# Altium schematic sheet Charging&1AOut1.SchDoc
size A; DocumentNumber: 4; SheetNumber: 4; SheetTotal: 7
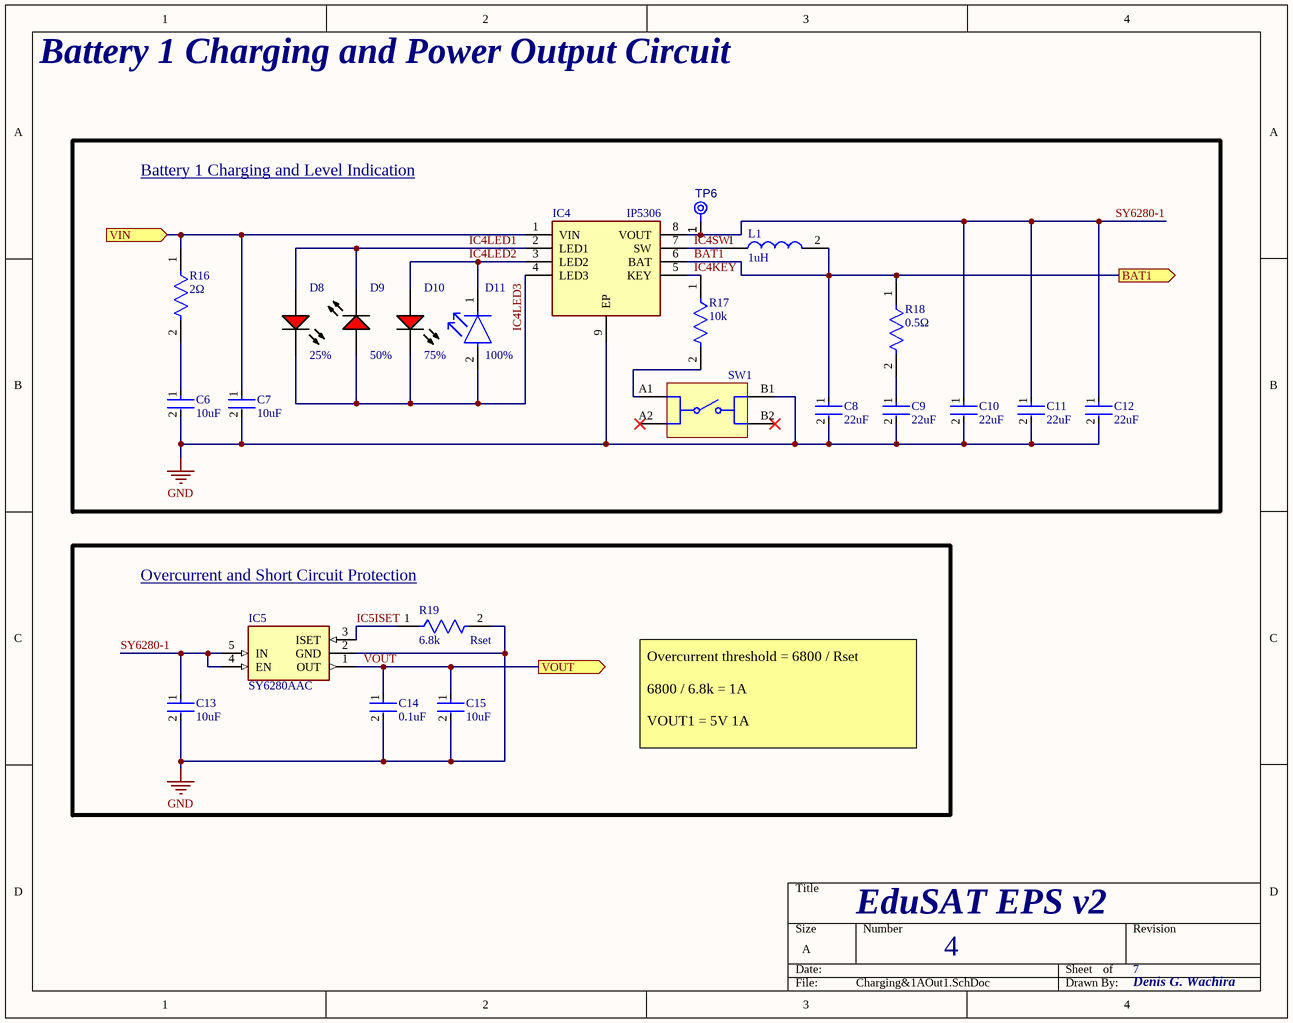
[diagram p0: Charging&1AOut1.SchDoc]

## Parts
C6  10uF  [FP-CL21-IPC_A]
C7  10uF  [FP-CL21-IPC_A]
C8  22uF  [FP-CL21-IPC_C]
C9  22uF  [FP-CL21-IPC_C]
C10  22uF  [FP-CL21-IPC_C]
C11  22uF  [FP-CL21-IPC_C]
C12  22uF  [FP-CL21-IPC_C]
C13  10uF  [FP-CL21-IPC_A]
C14  0.1uF  [FP-CL21-IPC_A]
C15  10uF  [FP-CL21-IPC_A]
D8  25%  [LTST-C170KRKT_V]
D9  50%  [LTST-C170KRKT_V]
D10  75%  [LTST-C170KRKT_V]
D11  100%  [FP-LTST-C170GKT-MFG]
IC4  IP5306  [SOIC127P600X165-9N]
IC5  SY6280AAC  [SOT95P285X140-5N]
L1  1uH  [INDPM7366X300N]
R16  2Ω  [FP-CR0805-IPC_B]
R17  10k  [FP-MCR10-IPC_C]
R18  0.5Ω  [FP-MCR10-IPC_C]
R19  6.8k          Rset  [FP-MCR10-IPC_C]
SW1  430181038816  [WS-TASV_L4.5W4.5H3.8_430181038816]  (value not drawn)
TP6  TPAD6R  [TP06R]  (value not drawn)  (no BOM)

## Blocks framed on the sheet
Battery 1 Charging and Level Indication: C6-C12 D8-D11 IC4 L1 R16-R18 SW1 TP6
Overcurrent and Short Circuit Protection: C13-C15 IC5 R19

## Ports
BAT1 (out, see EduSAT-EPSv2[3B], BatteryConn&Protection[3A]), VIN (in, see EduSAT-EPSv2[2B], Charging&1AOut2[1A], Charging&1AOut3[1A], PowerInput&Switch[4C]), VOUT (out, see EduSAT-EPSv2[3B], Charging&1AOut2[2C], Charging&1AOut3[2C], PowerOutput&Switch[1A])

## Nets
GND: C6.2 C7.2 C8.2 C9.2 C10.2 C11.2 C12.2 C13.2 C14.2 C15.2 IC4.9(EP) IC5.2(GND) R19.2 SW1.B1
BAT1: C8.1 IC4.6(BAT) L1.2 R18.1 ; port BAT1
IC4KEY: IC4.5(KEY) R17.1
IC4LED1: D8.1(A) D9.2(K) IC4.2(LED1)
IC4LED2: D10.1(A) D11.1(C) IC4.3(LED2)
IC4LED3: D8.2(K) D9.1(A) D10.2(K) D11.2(A) IC4.4(LED3)
IC4SW: IC4.7(SW) L1.1
IC5ISET: IC5.3(ISET) R19.1
SY6280-1: C10.1 C11.1 C12.1 C13.1 IC4.8(VOUT) IC5.4(EN) IC5.5(IN) TP6.1(TP)
VIN: C7.1 IC4.1(VIN) R16.1 ; port VIN
VOUT: C14.1 C15.1 IC5.1(OUT) ; port VOUT
NetC6_1: C6.1 R16.2
NetC9_1: C9.1 R18.2
NetR17_2: R17.2 SW1.A1

Not connected (* = marked no-connect by the designer): SW1 A2* B2*

## Notes on the sheet
- Battery 1 Charging and Power Output Circuit
- Overcurrent threshold = 6800 / Rset
  6800 / 6.8k = 1A
  VOUT1 = 5V 1A
- EduSAT EPS v2
- Denis G. Wachira

## Library data of the parts
C6 C7 C13 C15 = CMP-13271-002975-1: CL21 Series 0805 10uF 25V ±10% Tolerance X5R Multilayer Ceramic Chip Capacitor CL21A106KAYNNNE; Case Code (Imperial): 0805; Length: 2mm; Case/Package: 0805; Packaging: Tape and Reel; Width: 0.049inch; Tolerance: 10%; Mount: Surface Mount; Min Operating Temperature: -55°C; Thickness: 0.057inch; Height: 1.25mm; Dielectric: X5R; Package Quantity: 1; Depth: 1.25mm; Capacitance: 10uF; Voltage Rating: 25V; Case Code (Metric): 2012; Max Operating Temperature: 85°C; Radiation Hardening: No
C8-C12 = CMP-13271-003225-1: CL21 Series 0805 22uF 25V ±20% Tolerance X5R Multilayer Ceramic Chip Capacitor CL21A226MAYNNNE
C14 = CMP-13271-002975-1: 50V 0.1uF X7R ±10% 0805 Multilayer Ceramic Capacitors MLCC - SMD/SMT ROHS TCC0805X7R104K500DT; Case Code (Imperial): 0805; Length: 2mm; Case/Package: 0805; Packaging: Tape and Reel; Width: 0.049inch; Tolerance: 10%; Mount: Surface Mount; Min Operating Temperature: -55°C; Thickness: 0.057inch; Height: 1.25mm; Dielectric: X7R; Package Quantity: 1; Depth: 1.25mm; Capacitance: 0.1uF; Voltage Rating: 50V; Case Code (Metric): 2012; Max Operating Temperature: 85°C; Radiation Hardening: No
D8 = CMP-2000-07593-1: LED Red,KT-0805R; Manufacturer: Lite-On; Lens Transparency: Clear; Number of Elements: 1; Power Rating: 75mW; Luminous Intensity: 54mcd; Viewing Angle: 130degrees; Forward Current: 30mA; Wavelength: 639nm; Lens Style: Rectangular; Case\/Package: 0805; Test Current: 20mA; Dominant Wavelength: 631nm; Forward Voltage: 2V; Lens Colour: Colorless; Min Operating Temperature: -55degC; RoHSCompliant: True; Length: 3.2mm; Width: 1.25mm; Mount: SurfaceMount; Packaging: TapeandReel; Number of LEDs: 1; Radiation Hardening: No; Datasheet URL: http://optoelectronics.liteon.com/upload/download/DS-22-99-0150/LTST-C170KRKT.pdf; Datasheet Version: Rev. D, 11/2014; Case Code (Metric): 2012; Height: 1.1mm; Number of Pins: 2; Package Description: 2-Pin Surface Mount Device, Body 2 x 1.25 mm; Manufacturer URL: http://www.us.liteon.com/; Lead Free: LeadFree; Illumination Colour: Red; Colour: Red; Case Code (Imperial): 0805; Max Operating Temperature: 85degC; Power Dissipation: 75mW; Mounting Technology: SurfaceMount; Package Reference: C170KRKT; Package Quantity: 1; Depth: 1.6mm
D9 D10 = CMP-2000-07593-1: LED Red, KT-0805R; Manufacturer: Lite-On; Lens Transparency: Clear; Number of Elements: 1; Power Rating: 75mW; Luminous Intensity: 54mcd; Viewing Angle: 130degrees; Forward Current: 30mA; Wavelength: 639nm; Lens Style: Rectangular; Case\/Package: 0805; Test Current: 20mA; Dominant Wavelength: 631nm; Forward Voltage: 2V; Lens Colour: Colorless; Min Operating Temperature: -55degC; RoHSCompliant: True; Length: 3.2mm; Width: 1.25mm; Mount: SurfaceMount; Packaging: TapeandReel; Number of LEDs: 1; Radiation Hardening: No; Datasheet URL: http://optoelectronics.liteon.com/upload/download/DS-22-99-0150/LTST-C170KRKT.pdf; Datasheet Version: Rev. D, 11/2014; Case Code (Metric): 2012; Height: 1.1mm; Number of Pins: 2; Package Description: 2-Pin Surface Mount Device, Body 2 x 1.25 mm; Manufacturer URL: http://www.us.liteon.com/; Lead Free: LeadFree; Illumination Colour: Red; Colour: Red; Case Code (Imperial): 0805; Max Operating Temperature: 85degC; Power Dissipation: 75mW; Mounting Technology: SurfaceMount; Package Reference: C170KRKT; Package Quantity: 1; Depth: 1.6mm
D11 = CMP-1674-00002-6: LED GREEN CLEAR SMD KT-0805G; Dominant Wavelength: 569nm; Lens Style: Diffused; Forward Voltage: 2.1V; Number of Elements: 1; Wavelength: 565nm; Luminous Intensity: 6mcd; Test Current: 10mA; Power Dissipation: 100mW; Reverse Voltage: 5V; Forward Current: 30mA; Viewing Angle: 130°; Lens Color: Colorless; Min Operating Temperature: -55°C; Number of Pins: 2; Max Operating Temperature: 85°C; Color: Green; Radiation Hardening: No; Illumination Color: Green; Case Code (Metric): 2012; Lens Transparency: Clear; Case/Package: 0805; Width: 1.25mm; Case Code (Imperial): 0805; Package Quantity: 1; Height: 1.1mm; Depth: 1.25mm; Length: 2mm; Power Rating: 100mW; Lead Free: Lead Free; Number of LEDs: 1; Packaging: Tape and Reel; Mount: Surface Mount; Voltage: 5V
IC4 = IP5306: Integrated Circuit; Manufacturer_Name: INJOINIC; Datasheet Link: https://datasheetspdf.com/pdf-file/1139129/Injoinic/IP5306/1; Height: 1.65mm; Manufacturer_Part_Number: IP5306
IC5 = SY6280AAC: Integrated Circuit; Manufacturer_Name: Silergy; Datasheet Link: https://datasheet.lcsc.com/szlcsc/Silergy-Corp-SY6280AAC_C55136.pdf; Height: 1.4mm; Manufacturer_Part_Number: SY6280AAC
L1 = MCS0630-2R2MN2: Inductor MCS0630-1R0MN2; Manufacturer_Name: Prosperity Dielectrics; Height: 3mm; Manufacturer_Part_Number: MCS0630-1R0MN2
R16 = CMP-07231-004400-1: Thick Film Chip Resistors 0805 2Ω 0.125W 1% 250ppm/°C / RS-05L2R00FT; Power Rating: 125mW; Voltage Rating: 150V; Packaging: Tape and Reel; Thickness: 508um; Case Code (Metric): 2012; Military Standard: Not; Height: 0.5mm; Depth: 1.25mm; Weight: 0.000194oz; Length: 2mm; Resistance: 2Ω; Min Operating Temperature: -55°C; Radiation Hardening: No; Case/Package: 0805; Tolerance: 1%; Mount: Surface Mount; Width: 1.25mm; Max Operating Temperature: 155°C; Contact Plating: Tin; Temperature Coefficient: 250ppm/°C; Case Code (Imperial): 0805; Composition: Thick Film; Termination: SMD/SMT
R17 = CMP-08839-012433-1: Thick Film Chip Resistor, 0805, 10kΩ, 1%, 100ppm/°C, 0.125W, 150V / 0805W8F1002T5E; Resistance: 10kR; Power Rating: 125mW; Resistor Type: Thick Film; Contact Plating: Tin; Length: 2mm; Tolerance: 1%; Temperature Coefficient: 100ppm/°C; Max Operating Temperature: 155°C; Min Operating Temperature: -55°C; Height: 550um; Voltage Rating (DC): 150V; Mount: Surface Mount; Case/Package: 0805; Lead Free: Lead Free; Width: 1.25mm; Radiation Hardening: No; Working Voltage: 150V; Number of Terminations: 2
R18 = CMP-08839-012433-1: Thick Film Chip Resistor, 0805, 0.5R, 1%, 100ppm/°C, 0.125W, 150V / 0805W8F500LT5E; Resistance: 10kR; Power Rating: 125mW; Resistor Type: Thick Film; Contact Plating: Tin; Length: 2mm; Tolerance: 1%; Temperature Coefficient: 100ppm/°C; Max Operating Temperature: 155°C; Min Operating Temperature: -55°C; Height: 550um; Voltage Rating (DC): 150V; Mount: Surface Mount; Case/Package: 0805; Lead Free: Lead Free; Width: 1.25mm; Radiation Hardening: No; Working Voltage: 150V; Number of Terminations: 2
R19 = CMP-08839-012433-1: Thick Film Chip Resistor, 0805, 6.8kΩ, 1%, 100ppm/°C, 0.125W, 150V / 0805W8F6801T5E; Resistance: 10kR; Power Rating: 125mW; Resistor Type: Thick Film; Contact Plating: Tin; Length: 2mm; Tolerance: 1%; Temperature Coefficient: 100ppm/°C; Max Operating Temperature: 155°C; Min Operating Temperature: -55°C; Height: 550um; Voltage Rating (DC): 150V; Mount: Surface Mount; Case/Package: 0805; Lead Free: Lead Free; Width: 1.25mm; Radiation Hardening: No; Working Voltage: 150V; Number of Terminations: 2
SW1 = CMP-1454-00001-2: 4.5mm 3.5mm 50mA Round Button Brick nogging 4.5mm 260gf 12V SMD Tactile Switches ROHS / TSC015A03526A; NexarPartId: 57114477; Switch Function: Off-Mom; Actuator Material: Liquid Crystal Polymer, Polymer; Insulation Resistance: 100MΩ; Throw Configuration: SPST; Switch Travel: 200µm; Illumination Type: Non-Illuminated; Mechanical Life: 1Mcycles; Current Rating: 50mA; RoHS: Compliant; Termination: SMD/SMT; Packaging: Tape and Reel; Height: 3.8mm; Mount: Surface Mount; Max Operating Temperature: 85°C; Voltage Rating: 12V; Contact Plating: Silver; Min Operating Temperature: -40°C
TP6 = CMP-00028-00002-2: 0.6mm round; Pins: 1